# Altium schematic sheet status_leds.SchDoc
size A4
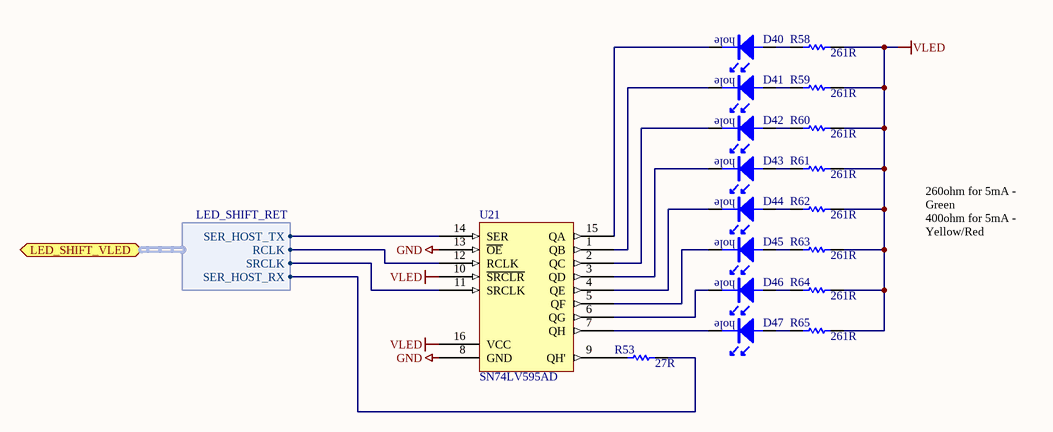
[diagram p0: status_leds.SchDoc]

## Parts
D40  (no value)  [LED0.1]
D41  (no value)  [LED0.1]
D42  (no value)  [LED0.1]
D43  (no value)  [LED0.1]
D44  (no value)  [LED0.1]
D45  (no value)  [LED0.1]
D46  (no value)  [LED0.1]
D47  (no value)  [LED0.1]
R53  27R  [0603]
R58  261R  [0603]
R59  261R  [0603]
R60  261R  [0603]
R61  261R  [0603]
R62  261R  [0603]
R63  261R  [0603]
R64  261R  [0603]
R65  261R  [0603]
U21  SN74LV595AD  [SOIC127P600X175-16N]

## Ports
LED_SHIFT_VLED (harness LED_SHIFT_RET)

## Harnesses
LED_SHIFT_RET: RCLK, SER_HOST_RX, SER_HOST_TX, SRCLK

## Nets
GND: U21.8(GND) U21.13(~{OE})
VLED: R58.1 R59.1 R60.1 R61.1 R62.1 R63.1 R64.1 R65.1 U21.10(~{SRCLR}) U21.16(VCC)
NetD40_A: D40.A R58.2
NetD40_K: D40.K U21.15(QA)
NetD41_A: D41.A R59.2
NetD41_K: D41.K U21.1(QB)
NetD42_A: D42.A R60.2
NetD42_K: D42.K U21.2(QC)
NetD43_A: D43.A R61.2
NetD43_K: D43.K U21.3(QD)
NetD44_A: D44.A R62.2
NetD44_K: D44.K U21.4(QE)
NetD45_A: D45.A R63.2
NetD45_K: D45.K U21.5(QF)
NetD46_A: D46.A R64.2
NetD46_K: D46.K U21.6(QG)
NetD47_A: D47.A R65.2
NetD47_K: D47.K U21.7(QH)
NetR53_1: R53.1 ; port LED_SHIFT_VLED.SER_HOST_RX
NetR53_2: R53.2 U21.9(QH')
NetU21_11: U21.11(SRCLK) ; port LED_SHIFT_VLED.SRCLK
NetU21_12: U21.12(RCLK) ; port LED_SHIFT_VLED.RCLK
NetU21_14: U21.14(SER) ; port LED_SHIFT_VLED.SER_HOST_TX

## Notes on the sheet
- 260ohm for 5mA - Green
  400ohm for 5mA - Yellow/Red
- (in symbol LED_HOLE) hole

## Library data of the parts
D40-D47 = LED_HOLE: through hole LED; Manufacturer: TT Electronics/Optek Technology; Manufacturer Part Number: OVLBG4C7; Description: LED 525NM ROUND GREEN 3MM; Color: Green; Millicandela Rating: 2000mcd; Voltage - Forward (Vf) Typ: 3.4V; Current - Test: 20mA; Wavelength - Dominant: 525nm; Wavelength - Peak: 521nm; Viewing Angle: 45°; Lens Type: Clear; Lens Style/Size: Round with Domed Top, 3mm, T-1; Supplier 1: Digi-Key; Supplier Part Number 1: 365-1174-ND; RoHS: RoHS Compliant; Category: Optoelectronics; Stock 1: 22554; Pricing 1: 1=0.61, 100=0.5516, 250=0.53544, 500=0.51918, 1000=0.48673, 2500=0.4705, 5000=0.45428, 25000=0.43805 (AUD); Packaging: Bulk; Package / Case: Radial; Size / Dimension: -; Height: 5.10mm; Mounting Type: Through Hole; Luminous Flux @ Current - Test: -; ComponentLink1URL: http://media.digikey.com/pdf/Data%20Sheets/Optek%20PDFs/OVLBG4C7.pdf; ComponentLink1Description: http://media.digikey.com/pdf/Data%20Sheets/Optek%20PDFs/OVLBG4C7.pdf
R53 = Res Semi: Semiconductor Resistor; Manufacturer: Panasonic Electronic Components; Manufacturer Part Number: ERJ-3EKF27R0V; Value: 1K; Description: RES 27 OHM 1/10W 1% 0603 SMD; Resistance (Ohms): 27; Power (Watts): 0.1W, 1/10W; Temperature Coefficient: ±100ppm/°C; Tolerance: ±1%; Published: 8-Jun-2000; LatestRevisionDate: 17-Jul-2002; LatestRevisionNote: Re-released for DXP Platform.; PackageReference: AXIAL-0.5; Publisher: Altium Limited; PackageDescription: Axial Device, Thru-Hole; 2 Leads; 0.5 in Pin Spacing; Supplier 1: Digi-Key; Supplier Part Number 1: P27.0HCT-ND; RoHS: RoHS Compliant; Category: Resistors; Stock 1: 89523; Pricing 1: 1=0.12, 50=0.0166, 100=0.0126, 250=0.00936, 500=0.00692, 1000=0.00461 (AUD); Packaging: Cut Tape (CT); Composition: Thick Film; Features: -; Package / Case: 0603 (1608 Metric); Supplier Device Package: 0603; Size / Dimension: 0.063" L x 0.031" W (1.60mm x 0.80mm); Height: 0.022" (0.55mm); Number of Terminations: 2; ComponentLink1URL: http://industrial.panasonic.com/www-cgi/jvcr13pz.cgi?E+PZ+3+AOA0002+ERJ3EKF27R0V+7+WW; ComponentLink1Description: http://industrial.panasonic.com/www-cgi/jvcr13pz.cgi?E+PZ+3+AOA0002+ERJ3EKF27R0V+7+WW
R58-R65 = Res Semi: Semiconductor Resistor; Manufacturer: Panasonic Electronic Components; Manufacturer Part Number: ERJ-3EKF2610V; Value: 1K; Description: RES 261 OHM 1/10W 1% 0603 SMD; Resistance (Ohms): 261; Power (Watts): 0.1W, 1/10W; Temperature Coefficient: ±100ppm/°C; Tolerance: ±1%; Published: 8-Jun-2000; LatestRevisionDate: 17-Jul-2002; LatestRevisionNote: Re-released for DXP Platform.; PackageReference: AXIAL-0.5; Publisher: Altium Limited; PackageDescription: Axial Device, Thru-Hole; 2 Leads; 0.5 in Pin Spacing; Supplier 1: Digi-Key; Supplier Part Number 1: P261HCT-ND; RoHS: RoHS Compliant; Category: Resistors; Stock 1: 84589; Pricing 1: 1=0.12, 50=0.0166, 100=0.0126, 250=0.00936, 500=0.00692, 1000=0.00461 (AUD); Packaging: Cut Tape (CT); Composition: Thick Film; Features: -; Package / Case: 0603 (1608 Metric); Supplier Device Package: 0603; Size / Dimension: 0.063" L x 0.031" W (1.60mm x 0.80mm); Height: 0.022" (0.55mm); Number of Terminations: 2; ComponentLink1URL: http://industrial.panasonic.com/www-cgi/jvcr13pz.cgi?E+PZ+3+AOA0002+ERJ3EKF2610V+7+WW; ComponentLink1Description: http://industrial.panasonic.com/www-cgi/jvcr13pz.cgi?E+PZ+3+AOA0002+ERJ3EKF2610V+7+WW
U21 = SN74LV595AD: 8-Bit Shift Registers with 3-State Output Registers; Manufacturer: Texas Instruments; Manufacturer Part Number: SN74LV595ADR; Description: IC 8-BIT SHFT REG TRI-ST 16-SOIC; Output Type: Tri-State; Number of Elements: 1; Number of Bits per Element: 8; Function: Serial to Parallel, Serial; Voltage - Supply: 2 V ~ 5.5 V; Supplier 1: Digi-Key; Supplier Part Number 1: 296-18747-1-ND; RoHS: RoHS Compliant; Category: Integrated Circuits (ICs); Stock 1: 11778; Pricing 1: 1=1.19, 10=1.041, 25=0.92, 100=0.8018, 250=0.698, 500=0.59416, 1000=0.47591 (AUD); Packaging: Cut Tape (CT); Logic Type: Shift Register; Operating Temperature: -40°C ~ 85°C; Mounting Type: Surface Mount; Package / Case: 16-SOIC (0.154", 3.90mm Width); Supplier Device Package: 16-SOIC N; ComponentLink1URL: http://www.ti.com/lit/ds/symlink/sn74lv595a.pdf; ComponentLink1Description: http://www.ti.com/lit/ds/symlink/sn74lv595a.pdf